# Altium project Battery Management System Rev3.PrjPcb
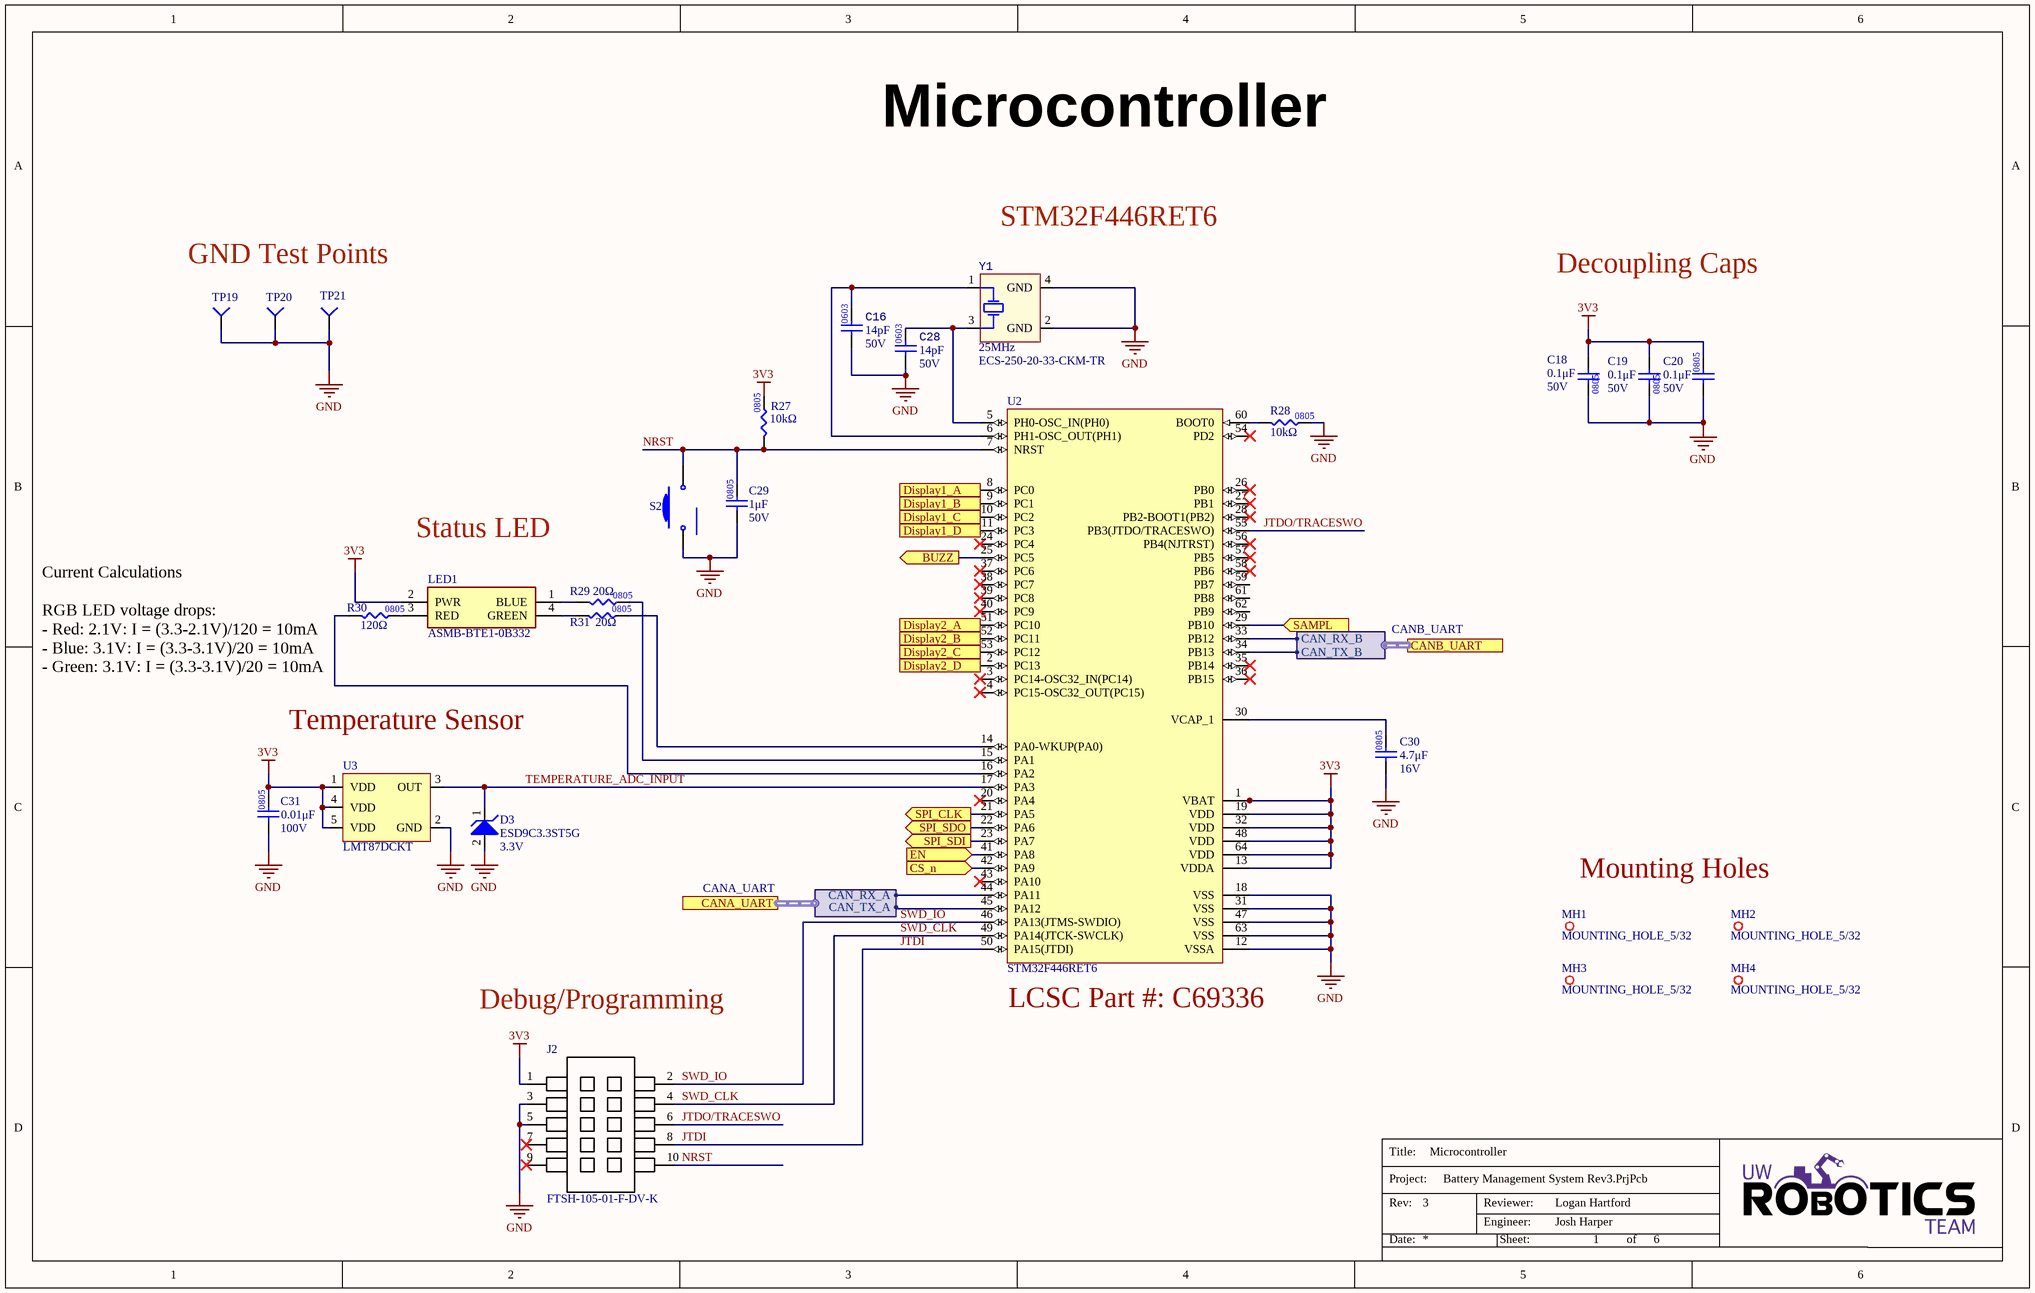
[diagram p0: Microcontroller.SchDoc]
6 sheets, 150 parts. Net scope: flat (ports and power ports of the same name join across sheets).
Board file: BMSRev3.PcbDoc
Sheets:
  Microcontroller.SchDoc
  BMSRev3.SchDoc
  BatteryBalancingRev3.SchDoc
  Display.SchDoc
  Power.SchDoc
  CAN.SchDoc

## Sheet Microcontroller.SchDoc: Microcontroller
size B; CheckedBy: Logan Hartford; Engineer: Josh Harper; Organization: UW Robotics; Address1: 200 University Avenue; Address2: Waterloo; Address3: Ontario; Address4: Canada N2L 3G6; DocumentNumber: 7; Revision: 3; SheetNumber: 1; SheetTotal: 6

### Parts
C16  value 14pF  Voltage Rating: 50V  [CAP0603]  (hidden comment: CAP_14pF_50V_0603)
C18  value 0.1μF  Voltage Rating: 50V  [CAP2012]  (hidden comment: CAP_0.1uF_50V_0805)
C19  value 0.1μF  Voltage Rating: 50V  [CAP2012]  (hidden comment: CAP_0.1uF_50V_0805)
C20  value 0.1μF  Voltage Rating: 50V  [CAP2012]  (hidden comment: CAP_0.1uF_50V_0805)
C28  value 14pF  Voltage Rating: 50V  [CAP0603]  (hidden comment: CAP_14pF_50V_0603)
C29  value 1μF  Voltage Rating: 50V  [CAP2012]  (hidden comment: CAP_1uF_50V_0805)
C30  value 4.7μF  Voltage Rating: 16V  [CAP0805]  (hidden comment: CAP_4.7uF_16V_0805)
C31  value 0.01μF  Voltage Rating: 100V  [CAP0805]  (hidden comment: CAP_0.01uF_100V_0805)
D3  ESD9C3.3ST5G  Voltage: 3.3V  [ESD9C3.3ST5G]
J2  Manufacturer Part Number 1: FTSH-105-01-F-DV-K  [FTSH-105-01-F-DV-K-P-TR]  (hidden comment: CON_PROGRAMMING)
LED1  ASMB-BTE1-0B332  [ASMBBTE10B332]
MH1  MOUNTING_HOLE_5/32  [MOUNTING_HOLE_5/38]  (no BOM)
MH2  MOUNTING_HOLE_5/32  [MOUNTING_HOLE_5/38]  (no BOM)
MH3  MOUNTING_HOLE_5/32  [MOUNTING_HOLE_5/38]  (no BOM)
MH4  MOUNTING_HOLE_5/32  [MOUNTING_HOLE_5/38]  (no BOM)
R27  value 10kΩ  [RES0805]  (hidden comment: RES_10kΩ_0805_5%)
R28  value 10kΩ  [RES0805]  (hidden comment: RES_10kΩ_0805_5%)
R29  value 20Ω  [RES0805]  (hidden comment: RES_20Ω_0805_1%)
R30  value 120Ω  [RES0805]  (hidden comment: RES_120Ω_0805_1%)
R31  value 20Ω  [RES0805]  (hidden comment: RES_20Ω_0805_1%)
S2  SW_PUSHBUTTON  [TACTILE_SWITCH_SMD]  (value not drawn)
TP19  TESTPOINT_SMD_LOOP  [S1751-46R]  (value not drawn)
TP20  TESTPOINT_SMD_LOOP  [S1751-46R]  (value not drawn)
TP21  TESTPOINT_SMD_LOOP  [S1751-46R]  (value not drawn)
U2  STM32F446RET6  [STM-LQFP64_L]
U3  Manufacturer Part Number 1: LMT87DCKT  [SOT65P210X110-5N]  (hidden comment: IC_TEMP_SENSOR_2)
Y1  Frequency: 25MHz  Manufacturer Part Number 1: ECS-250-20-33-CKM-TR  [XTAL_ECS-250-20-33-CKM-TR]  (hidden comment: CRYSTAL_25MHZ_20PF)

### Ports
BUZZ (out), CANA_UART (harness CANA_UART), CANB_UART (harness CANB_UART), CS_n (in), Display1_A (out), Display1_B (out), Display1_C (out), Display1_D (out), Display2_A (out), Display2_B (out), Display2_C (out), Display2_D (out), EN (in), SAMPL (in), SPI_CLK (out), SPI_SDI (out), SPI_SDO (out)

### Harnesses
CANB_UART: CAN_RX_B, CAN_TX_B
CANA_UART: CAN_RX_A, CAN_TX_A

### Nets
3V3: C18.2 C19.2 C20.2 C31.2 J2.1 LED1.2(PWR) R27.2 U2.1(VBAT) U2.13(VDDA) U2.19(VDD) U2.32(VDD) U2.48(VDD) U2.64(VDD) U3.1(VDD) U3.4(VDD) U3.5(VDD)
GND: C16.1 C18.1 C19.1 C20.1 C28.1 C29.1 C30.1 C31.1 D3.2 J2.3 J2.5 R28.2 S2.1 TP19.1(=value) TP20.1(=value) TP21.1(=value) U2.12(VSSA) U2.18(VSS) U2.31(VSS) U2.47(VSS) U2.63(VSS) U3.2(GND) Y1.2(GND) Y1.4(GND)
EN: U2.41(PA8) ; port EN
JTDI: J2.8 U2.50(PA15(JTDI))
JTDO/TRACESWO: J2.6 U2.55(PB3(JTDO/TRACESWO))
NRST: C29.2 J2.10 R27.1 S2.2 U2.7(NRST)
SWD_CLK: J2.4 U2.49(PA14(JTCK-SWCLK))
SWD_IO: J2.2 U2.46(PA13(JTMS-SWDIO))
TEMPERATURE_ADC_INPUT: D3.1 U2.17(PA3) U3.3(OUT)
NetC16_2: C16.2 U2.6(PH1-OSC_OUT(PH1)) Y1.1(HOT)
NetC28_2: C28.2 U2.5(PH0-OSC_IN(PH0)) Y1.3(HOT)
NetC30_2: C30.2 U2.30(VCAP_1)
NetLED1_1: LED1.1(BLUE) R29.1
NetLED1_3: LED1.3(RED) R30.2
NetLED1_4: LED1.4(GREEN) R31.1
NetQ1_1: U2.25(PC5) ; port BUZZ
NetR28_1: R28.1 U2.60(BOOT0)
NetR29_2: R29.2 U2.15(PA1)
NetR30_1: R30.1 U2.16(PA2)
NetR31_2: R31.2 U2.14(PA0-WKUP(PA0))
NetTP16_1: U2.21(PA5) ; port SPI_CLK
NetTP17_1: U2.23(PA7) ; port SPI_SDI
NetTP18_1: U2.22(PA6) ; port SPI_SDO
NetU1_4: U2.29(PB10) ; port SAMPL
NetU1_80: U2.42(PA9) ; port CS_n
NetU2_2: U2.2(PC13) ; port Display2_D
NetU2_8: U2.8(PC0) ; port Display1_A
NetU2_9: U2.9(PC1) ; port Display1_B
NetU2_10: U2.10(PC2) ; port Display1_C
NetU2_11: U2.11(PC3) ; port Display1_D
NetU2_33: U2.33(PB12) ; port CANB_UART.CAN_RX_B
NetU2_34: U2.34(PB13) ; port CANB_UART.CAN_TX_B
NetU2_44: U2.44(PA11) ; port CANA_UART.CAN_RX_A
NetU2_45: U2.45(PA12) ; port CANA_UART.CAN_TX_A
NetU2_51: U2.51(PC10) ; port Display2_A
NetU2_52: U2.52(PC11) ; port Display2_B
NetU2_53: U2.53(PC12) ; port Display2_C

Not connected (* = marked no-connect by the designer): J2 7* 9*; U2 3(PC14-OSC32_IN(PC14))* 4(PC15-OSC32_OUT(PC15))* 20(PA4)* 24(PC4)* 26(PB0)* 27(PB1)* 28(PB2-BOOT1(PB2))* 35(PB14)* 36(PB15)* 37(PC6)* 38(PC7)* 39(PC8)* 40(PC9)* 43(PA10)* 54(PD2)* 56(PB4(NJTRST))* 57(PB5)* 58(PB6)* 59(PB7) 61(PB8) 62(PB9)

### Notes on the sheet
- Microcontroller
- STM32F446RET6
- GND Test Points
- Decoupling Caps
- Status LED
- (near R30) Current Calculations
  RGB LED voltage drops:
  - Red: 2.1V: I = (3.3-2.1V)/120 = 10mA
  - Blue: 3.1V: I = (3.3-3.1V)/20 = 10mA
  - Green: 3.1V: I = (3.3-3.1V)/20 = 10mA
- Temperature Sensor
- Mounting Holes
- Debug/Programming
- (near U2) LCSC Part #: C69336
- Title:
- Project:
- Date:
- Rev:
- Reviewer:
- Engineer:
- Sheet:
- of

### Library data of the parts
C16 C28 = CAP_14pF_50V_0603: CAP CER 14PF 50V C0G/NP0 0603; Manufacturer 1: Samsung; Manufacturer Part Number 1: CL10C140JB8NNNC; Dielectric: C0G; Supplier 1: Digi-Key; Supplier Part Number 1: 1276-2187-1-ND; Mounting Type: SMD; Package: 0603
C18-C20 = CAP_0.1uF_50V_0805: CAP CER 0.1UF 50V X7R 0805; Manufacturer Part Number 1: GCM21BR71H104KA37K; Manufacturer 1: Murata Electronics; Package/Footprint: 0805; Supplier Part Number 1: 490-8049-1-ND; Supplier 1: Digi-Key; Dielectric: X7R; LCSC Part #: C49678; Mounting Type: SMD
C29 = CAP_1uF_50V_0805: CAP CER 1UF 50V X7R 0805; Manufacturer 1: Samsung Electro-Mechanics; Manufacturer Part Number 1: CL21B105KBFNNNG; Supplier 1: Digi-Key; Supplier Part Number 1: 1276-6470-1-ND; LCSC Part #: C28323; Mounting Type: SMD; Package: 0805
C30 = CAP_4.7uF_16V_0805: CAP CER 4.7UF 16V X5R 0805; Manufacturer Part Number 1: CL21A475KOFNNNE; Manufacturer 1: Samsung Electro-Mechanics; Supplier Part Number 1: 1276-1065-1-ND; Supplier 1: Digi-Key; Dielectric: X5R; LCSC Part #: C1779; Mounting Type: SMD; Package: 0805
C31 = CAP_0.01uF_100V_0805: CAP CER 0.01uF 100V X7R 0805; Manufacturer Part Number 1: 08051C103KAT2A; Manufacturer 1: AVX Corporation; Supplier Part Number 1: 478-1358-1-ND; Supplier 1: Digi-Key; Dielectric: X7R; LCSC Part #: C1710; Mounting Type: SMD; Package: 0805
D3 = ESD9C3.3ST5G: TVS DIODE 3.3VWM SOD923; Manufacturer Part Number 1: ESD9C3.3ST5G
J2 = CON_PROGRAMMING: CONN HEADER SMD 10POS 1.27MM; Manufacturer 1: Samtec; Supplier 1: Digi-Key; Pitch: 1.27mm; Supplier Part Number 1: SAM8796-ND; Mounting Type: SMD
LED1 = ASMB-BTE1-0B332: LED RGB DIFFUSED 4PLCC SMD; Manufacturer_Name: Avago Technologies; Datasheet Link: https://docs.broadcom.com/doc/AV02-4236EN; Height: 2.1mm; Mouser Part Number: 630-ASMB-BTE1-0B332; Mouser Price/Stock: https://www.mouser.co.uk/ProductDetail/Broadcom-Avago/ASMB-BTE1-0B332?qs=ToP8pWlZ0bOzYR3dfJnh3g%3D%3D; Manufacturer Part Number 1: ASMB-BTE1-0B332
R27 R28 = RES_10kΩ_0805_5%: RES 10K OHM 5% 1/8W 0805; Manufacturer 1: Panasonic Electronic Components; Manufacturer Part Number 1: ERJ-6GEYJ103V; Package/Footprint: 0805; Supplier Part Number 1: P10KACT-ND; Supplier 1: Digi-Key; LCSC Part #: C17414; Mounting Type: SMD
R29 R31 = RES_20Ω_0805_1%: RES 20 OHM 1% 1/8W 0805; Manufacturer 1: Yageo; Manufacturer Part Number 1: RC0805FR-0720RL; Supplier Part Number 1: 311-20.0CRCT-ND; Supplier 1: Digi-Key; LCSC Part #: C17581; Mounting Type: SMD; Package: 0805
R30 = RES_120Ω_0805_1%: RES 120 OHM 1% 1/8W 0805; Manufacturer 1: Vishay; Manufacturer Part Number 1: CRCW0805120RFKEA; Package/Footprint: 0805; Supplier Part Number 1: 541-120CCT-ND; Supplier 1: Digi-Key; LCSC Part #: C17437; Mounting Type: SMD
S2 = SW_PUSHBUTTON: SMT 3.0 X 2.6 MM TACT SWITCH WIT; Manufacturer Part Number 1: 435151014824; Manufacturer 1: Würth Elektronik; Supplier 1: Digi-Key; Supplier Part Number 1: 732-435151014824CT-ND
TP19-TP21 = TESTPOINT_SMD_LOOP: TESTPOINT SMD LOOP; Manufacturer 1: Harwin; Supplier 1: Digi-Key; Manufacturer Part Number 1: S1751-46R; Mounting Type: SMD; Package/Footprint: SMD; Supplier Part Number 1: 952-1478-1-ND
U2 = MCU_STM32F446RET6: ARM Cortex-M4 32-bit MCU+FPU, 512 KB Flash, 128 KB Internal RAM, 50 I/Os, 64-Pin LQFP, -40 to 85 degC, Tray; I/Os (High Current): 50; Supply Voltage(Vcc) min (V): 1.7; Operating Frequency(F) (Processor speed) (MHz): 180; D/A Converter: 2; Internal RAM Size (kB): 128; FLASH Size (Prog) (kB): 512; Core: ARM Cortex-M4; ComponentLink1Description: Manufacturer URL; Package Reference: 64-Pin Low-profile Quad Flat Package, Body 10 x 10 mm, Pitch 0.5 mm; ComponentLink2URL: http://www.st.com/st-web-ui/static/active/en/resource/technical/document/datasheet/DM00141306.pdf; Packing: Tray; DatasheetVersion: Rev. 6; ComponentLink1URL: http://www.st.com/; ComponentLink2Description: Datasheet; Package Description: LQFP64; Mounting Technology: Surface Mount; Supplier Part Number 1: 497-15376-ND; Supplier 1: Digi-Key
U3 = IC_TEMP_SENSOR_2: SENSOR ANALOG -50C-150C SC70-5; Manufacturer 1: Texas Instruments; Supplier Part Number 1: 296-35730-1-ND; Supplier 1: Digi-Key; Mounting Type: SMD; Package/Footprint: SC70-5
Y1 = CRYSTAL_25MHZ_20PF: CRYSTAL 25.0000MHZ 20PF SMD; Manufacturer 1: ECS Inc.; Load Capacitance: 20pF; Supplier 1: Digi-Key; Supplier Part Number 1: XC1817CT-ND; Mounting Type: SMD; Package/Footprint: SMD

## Sheet BMSRev3.SchDoc: BMS
size 279 x 215 mm; CheckedBy: Farris Matar; Engineer: Josh Harper; Revision: 3; SheetNumber: 2; SheetTotal: 6
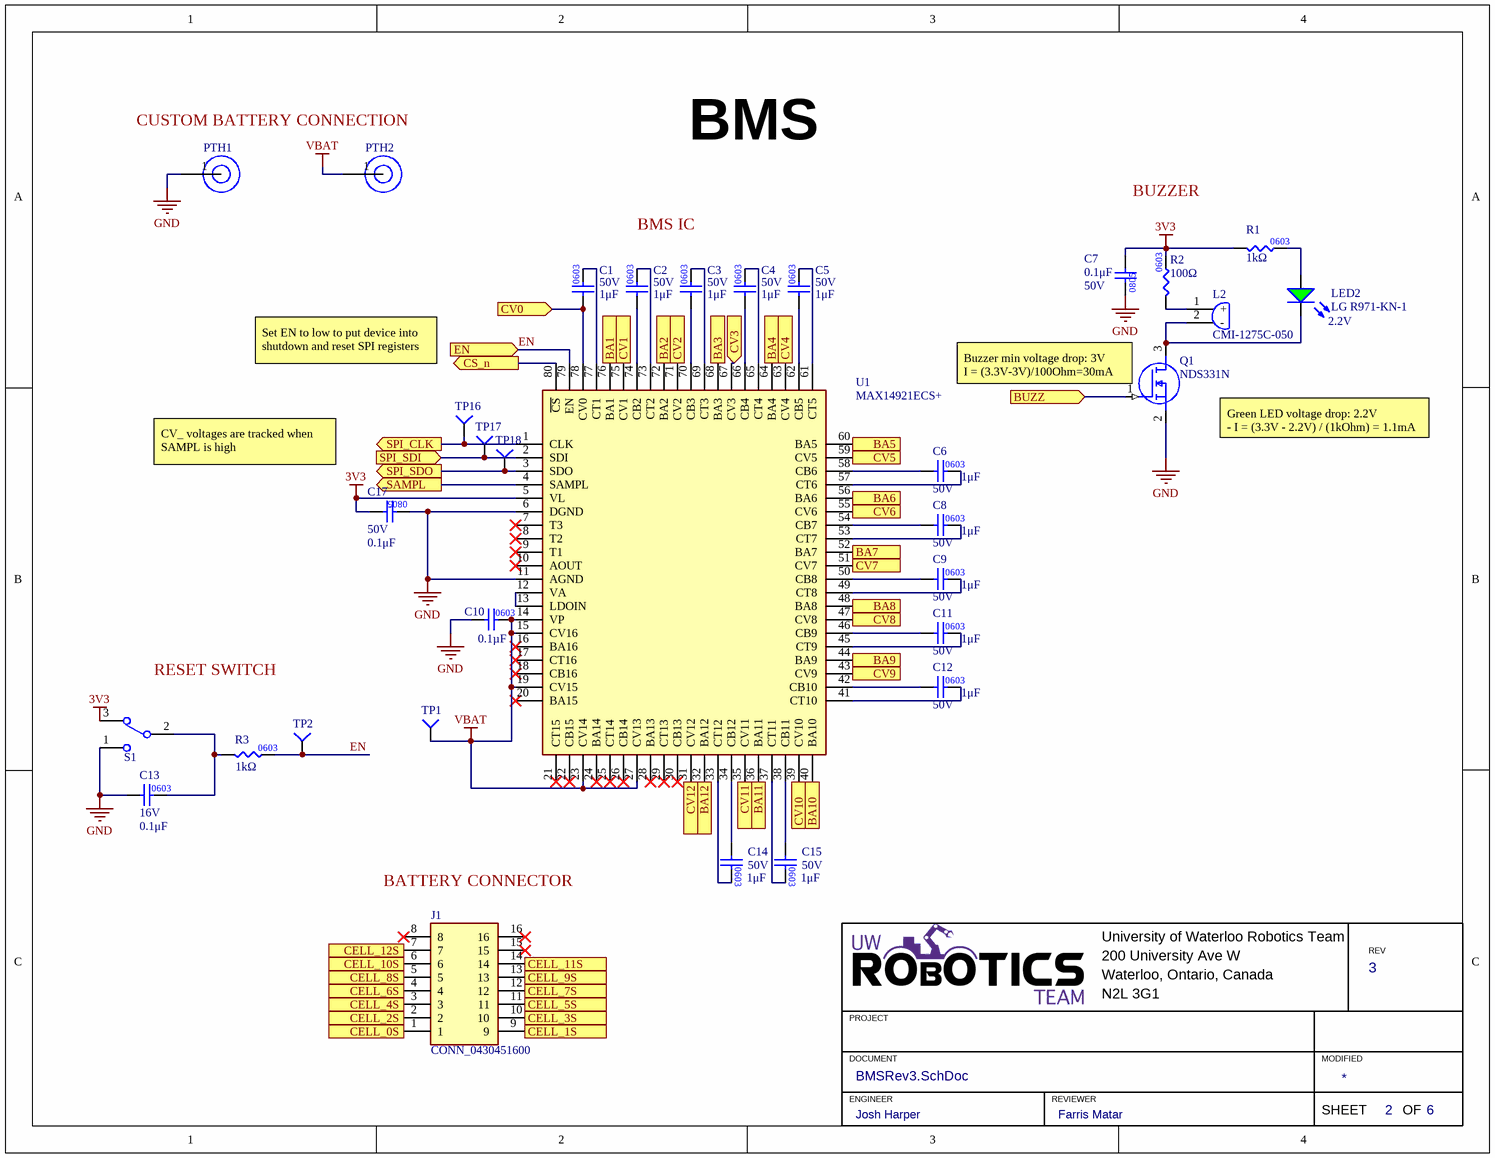
[diagram p1: BMSRev3.SchDoc]

### Parts
C1  value 1μF  Voltage Rating: 50V  [CAP0603]  (hidden comment: CAP_1uF_50V_0603)
C2  value 1μF  Voltage Rating: 50V  [CAP0603]  (hidden comment: CAP_1uF_50V_0603)
C3  value 1μF  Voltage Rating: 50V  [CAP0603]  (hidden comment: CAP_1uF_50V_0603)
C4  value 1μF  Voltage Rating: 50V  [CAP0603]  (hidden comment: CAP_1uF_50V_0603)
C5  value 1μF  Voltage Rating: 50V  [CAP0603]  (hidden comment: CAP_1uF_50V_0603)
C6  value 1μF  Voltage Rating: 50V  [CAP0603]  (hidden comment: CAP_1uF_50V_0603)
C7  value 0.1μF  Voltage Rating: 50V  [CAP2012]  (hidden comment: CAP_0.1uF_50V_0805)
C8  value 1μF  Voltage Rating: 50V  [CAP0603]  (hidden comment: CAP_1uF_50V_0603)
C9  value 1μF  Voltage Rating: 50V  [CAP0603]  (hidden comment: CAP_1uF_50V_0603)
C10  value 0.1µF  [CAP0603]  (hidden comment: CAP_0.1uF_10V_0603)
C11  value 1μF  Voltage Rating: 50V  [CAP0603]  (hidden comment: CAP_1uF_50V_0603)
C12  value 1μF  Voltage Rating: 50V  [CAP0603]  (hidden comment: CAP_1uF_50V_0603)
C13  value 0.1μF  Voltage Rating: 16V  [CAP0603]  (hidden comment: CAP_0.1uF_16V_0603)
C14  value 1μF  Voltage Rating: 50V  [CAP0603]  (hidden comment: CAP_1uF_50V_0603)
C15  value 1μF  Voltage Rating: 50V  [CAP0603]  (hidden comment: CAP_1uF_50V_0603)
C17  value 0.1μF  Voltage Rating: 50V  [CAP2012]  (hidden comment: CAP_0.1uF_50V_0805)
J1  CONN_0430451600  [0430451600]
L2  CMI-1275C-050  [CMI1275C050]
LED2  Forward Voltage Drop: 2.2V  Manufacturer Part Number 1: LG R971-KN-1  [LED_0805_GREEN]  (hidden comment: LED_GREEN)
PTH1  PTH  [PTH]  (value not drawn)
PTH2  PTH  [PTH]  (value not drawn)
Q1  NDS331N  [SOT95P251X112-3N]
R1  value 1kΩ  [RES0603]  (hidden comment: RES_1kΩ_0603_5%)
R2  value 100Ω  [RES0603]  (hidden comment: RES_100Ω_0603_1%)
R3  value 1kΩ  [RES0603]  (hidden comment: RES_1kΩ_0603_5%)
S1  SW_TOGGLE_SPDT  [100SP1T1B4M2QE]  (value not drawn)
TP1  TESTPOINT_1MM_SQUARE  [TESTPOINT_SQUARE_1MM]  (value not drawn)  (no BOM)
TP2  TESTPOINT_1MM_SQUARE  [TESTPOINT_SQUARE_1MM]  (value not drawn)  (no BOM)
TP16  TESTPOINT_1MM_SQUARE  [TESTPOINT_SQUARE_1MM]  (value not drawn)  (no BOM)
TP17  TESTPOINT_1MM_SQUARE  [TESTPOINT_SQUARE_1MM]  (value not drawn)  (no BOM)
TP18  TESTPOINT_1MM_SQUARE  [TESTPOINT_SQUARE_1MM]  (value not drawn)  (no BOM)
U1  MAX14921ECS+  [QFP50P1400X1400X120-80N]

### Ports
BA1 (out), BA2 (out), BA3 (out), BA4 (out), BA5 (out), BA6 (out), BA7 (out), BA8 (out), BA9 (out), BA10 (out), BA11 (out), BA12 (out), BUZZ (in), CELL_0S (out), CELL_1S (out), CELL_2S (out), CELL_3S (out), CELL_4S (out), CELL_5S (out), CELL_6S (out), CELL_7S (out), CELL_8S (out), CELL_9S (out), CELL_10S (out), CELL_11S (out), CELL_12S (out), CS_n (out), CV0 (in), CV1 (in), CV2 (in), CV3 (in), CV4 (in), CV5 (in), CV6 (in), CV7 (in), CV8 (in), CV9 (in), CV10 (in), CV11 (in), CV12 (in), EN (in), SAMPL (out), SPI_CLK (out), SPI_SDI (in), SPI_SDO (out)

### Nets
3V3: C7.2 C17.2 R1.1 R2.2 S1.3 U1.5(VL)
GND: C1.1 C7.1 C10.1 C13.1 C17.1 J1.1 PTH1.1 Q1.2(S) S1.1 U1.6(DGND) U1.11(AGND) U1.78(CV0) ; port CELL_0S, port CV0
VBAT: C10.2 PTH2.1 TP1.1(=value) U1.14(VP) U1.15(CV16) U1.19(CV15) U1.23(CV14) U1.27(CV13)
Cell6: J1.4 ; port CELL_6S
EN: R3.2 TP2.1(=value) U1.79(EN) ; port EN
NetC1_2: C1.2 U1.77(CT1)
NetC2_1: C2.1 U1.74(CB2)
NetC2_2: C2.2 U1.73(CT2)
NetC3_1: C3.1 U1.70(CB3)
NetC3_2: C3.2 U1.69(CT3)
NetC4_1: C4.1 U1.66(CB4)
NetC4_2: C4.2 U1.65(CT4)
NetC5_1: C5.1 U1.62(CB5)
NetC5_2: C5.2 U1.61(CT5)
NetC6_1: C6.1 U1.58(CB6)
NetC6_2: C6.2 U1.57(CT6)
NetC8_1: C8.1 U1.54(CB7)
NetC8_2: C8.2 U1.53(CT7)
NetC9_1: C9.1 U1.50(CB8)
NetC9_2: C9.2 U1.49(CT8)
NetC11_1: C11.1 U1.46(CB9)
NetC11_2: C11.2 U1.45(CT9)
NetC12_1: C12.1 U1.42(CB10)
NetC12_2: C12.2 U1.41(CT10)
NetC13_2: C13.2 R3.1 S1.2
NetC14_1: C14.1 U1.34(CB12)
NetC14_2: C14.2 U1.33(CT12)
NetC15_1: C15.1 U1.38(CB11)
NetC15_2: C15.2 U1.37(CT11)
NetJ1_2: J1.2 ; port CELL_2S
NetJ1_3: J1.3 ; port CELL_4S
NetJ1_5: J1.5 ; port CELL_8S
NetJ1_6: J1.6 ; port CELL_10S
NetJ1_7: J1.7 U1.31(CV12) ; port CV12, port CELL_12S
NetJ1_9: J1.9 ; port CELL_1S
NetJ1_10: J1.10 ; port CELL_3S
NetJ1_11: J1.11 ; port CELL_5S
NetJ1_12: J1.12 ; port CELL_7S
NetJ1_13: J1.13 ; port CELL_9S
NetJ1_14: J1.14 ; port CELL_11S
NetL2_1: L2.1(+) R2.1
NetL2_2: L2.2(-) LED2.2(K) Q1.3(D)
NetLED2_1: LED2.1(A) R1.2
NetQ1_1: Q1.1(G) ; port BUZZ
NetQ2_1: U1.32(BA12) ; port BA12
NetQ3_1: U1.56(BA6) ; port BA6
NetQ4_1: U1.60(BA5) ; port BA5
NetQ5_1: U1.36(BA11) ; port BA11
NetQ6_1: U1.40(BA10) ; port BA10
NetQ7_1: U1.64(BA4) ; port BA4
NetQ8_1: U1.44(BA9) ; port BA9
NetQ9_1: U1.68(BA3) ; port BA3
NetQ10_1: U1.48(BA8) ; port BA8
NetQ11_1: U1.72(BA2) ; port BA2
NetQ12_1: U1.52(BA7) ; port BA7
NetQ13_1: U1.76(BA1) ; port BA1
NetR4_2: U1.55(CV6) ; port CV6
NetR7_2: U1.59(CV5) ; port CV5
NetR8_2: U1.35(CV11) ; port CV11
NetR11_2: U1.39(CV10) ; port CV10
NetR12_2: U1.63(CV4) ; port CV4
NetR15_2: U1.43(CV9) ; port CV9
NetR16_2: U1.67(CV3) ; port CV3
NetR19_2: U1.47(CV8) ; port CV8
NetR20_2: U1.71(CV2) ; port CV2
NetR23_2: U1.51(CV7) ; port CV7
NetR24_2: U1.75(CV1) ; port CV1
NetTP16_1: TP16.1(=value) U1.1(CLK) ; port SPI_CLK
NetTP17_1: TP17.1(=value) U1.2(SDI) ; port SPI_SDI
NetTP18_1: TP18.1(=value) U1.3(SDO) ; port SPI_SDO
NetU1_4: U1.4(SAMPL) ; port SAMPL
NetU1_12: U1.12(VA) U1.13(LDOIN)
NetU1_80: U1.80(~{CS}) ; port CS_n

Not connected (* = marked no-connect by the designer): J1 8* 15* 16*; U1 7(T3)* 8(T2)* 9(T1)* 10(AOUT)* 16(BA16)* 17(CT16)* 18(CB16)* 20(BA15)* 21(CT15)* 22(CB15)* 24(BA14)* 25(CT14)* 26(CB14)* 28(BA13)* 29(CT13)* 30(CB13)*

### Notes on the sheet
- CUSTOM BATTERY CONNECTION
- BMS IC
- BUZZER
- Set EN to low to put device into shutdown and reset SPI registers
- (near Q1) Buzzer min voltage drop: 3V
  I = (3.3V-3V)/100Ohm=30mA
- Green LED voltage drop: 2.2V
  - I = (3.3V - 2.2V) / (1kOhm) = 1.1mA
- CV_ voltages are tracked when SAMPL is high
- (near S1) RESET SWITCH
- (near J1) BATTERY CONNECTOR
- University of Waterloo Robotics Team
- 200 University Ave W
- REV
- PROJECT
- Waterloo, Ontario, Canada
- N2L 3G1
- DOCUMENT
- ENGINEER
- REVIEWER
- MODIFIED
- SHEET
- OF
- (in symbol CAP_0.1uF_10V_0603) 0603
- (in symbol CAP_1uF_50V_0603) 0603
- (in symbol RES_100Ω_0603_1%) 0603

### Library data of the parts
C1-C6 C8 C9 C11 C12 C14 C15 = CAP_1uF_50V_0603: CAP CER 1UF 50V X6S 0603; Manufacturer Part Number 1: C1608X6S1H105K080AC; Manufacturer 1: TDK Corporation; Supplier Part Number 1: 445-7424-1-ND; Supplier 1: Digi-Key; Dielectric: X6S
C7 C17 = CAP_0.1uF_50V_0805: as C18 on sheet Microcontroller; Supplier Part Number 1: 490-8049-1-ND; Supplier 1: Digi-Key; Dielectric: X7R; LCSC Part #: C49678; Mounting Type: SMD
C10 = CAP_0.1uF_10V_0603: CAP CER 0.1UF 10V X7R 0402; Manufacturer 1: Murata Electronics; Manufacturer Part Number 1: GRM155R71A104KA01D; Package/Footprint: 0402; Supplier 1: Digi-Key; Supplier Part Number 1: 490-6321-1-ND; Voltage Rating: 10V
C13 = CAP_0.1uF_16V_0603: CAP CER 0.1UF 16V X7R 0603; Manufacturer Part Number 1: CC0603KRX7R7BB104; Manufacturer 1: Yageo; Package/Footprint: 0603; Supplier Part Number 1: 311-1088-1-ND; Supplier 1: Digi-Key; Dielectric: X7R; LCSC Number: C108079
J1 = CONN_0430451600: Connector 16 Pin AJX; Manufacturer_Name: Molex; Datasheet Link: https://www.molex.com/pdm_docs/sd/430451600_sd.pdf; Height: 9.02mm; Arrow Part Number: 0430451600; Arrow Price/Stock: https://www.arrow.com/en/products/0430451600/molex; Manufacturer Part Number 1: 0430451600
L2 = CMI-1275C-050: Inductor; Manufacturer_Name: CUI Inc.; Datasheet Link: https://componentsearchengine.com/Datasheets/1/CMI-1275C-050.pdf; Height: 8mm; Mouser Part Number: 490-CMI-1275C-050; Mouser Price/Stock: https://www.mouser.co.uk/ProductDetail/CUI-Devices/CMI-1275C-050?qs=qCxwlXJ4fnyWvfqXc%252BNqAA%3D%3D; Arrow Part Number: CMI-1275C-050; Arrow Price/Stock: https://www.arrow.com/en/products/cmi-1275c-050/cui-inc; Manufacturer Part Number 1: CMI-1275C-050
LED2 = LED_GREEN: LED GREEN DIFFUSED 0805 SMD; Manufacturer 1: OSRAM; Package/Footprint: 0805; Supplier Part Number 1: 475-1410-1-ND; Supplier 1: Digi-Key; Mounting Type: SMD
Q1 = NDS331N: MOSFET (N-Channel); Manufacturer_Name: onsemi; Datasheet Link: https://www.onsemi.com/pub/Collateral/NDS331N-D.PDF; Height: 1.12mm; Mouser Part Number: 512-NDS331N; Mouser Price/Stock: https://www.mouser.co.uk/ProductDetail/ON-Semiconductor-Fairchild/NDS331N?qs=FOlmdCx%252BAA2del7Yv4IvDw%3D%3D; Manufacturer Part Number 1: NDS331N
R1 R3 = RES_1kΩ_0603_5%: RES 1K OHM 5% 1/10W 0603; Manufacturer 1: Yageo; Manufacturer Part Number 1: RC0603JR-071KL; Package/Footprint: 0603; Supplier Part Number 1: 311-1.0KGRCT-ND; Supplier 1: Digi-Key; Mounting Type: SMD; LCSC Number: C14676
R2 = RES_100Ω_0603_1%: RES 100 OHM 1% 1/10W 0603; Manufacturer 1: Yageo; Manufacturer Part Number 1: RC0603FR-07100RL; Supplier Part Number 1: 311-100HRCT-ND; Supplier 1: Digi-Key
S1 = SW_TOGGLE_SPDT: SWITCH TOGGLE SPDT 5A 120V; Manufacturer 1: E-Switch; Voltage Rating (DC): 28V; Package/Footprint: TH; Supplier 1: Digi-Key; Mounting Type: TH; Throw Configuration: SPDT; Supplier Part Number 1: EG2355-ND; Manufacturer Part Number 1: 100SP1T1B4M2QE
TP1 TP2 TP16-TP18 = TESTPOINT_1MM_SQUARE: TESTPOINT 1MM SQUARE
U1 = MAX14921ECS+: IC 16s BMS; Manufacturer_Name: Maxim Integrated; Datasheet Link: http://pdfserv.maximintegrated.com/package_dwgs/21-0072.PDF; Height: 1.2mm; Mouser Part Number: 700-MAX14921ECS+; Mouser Price/Stock: https://www.mouser.co.uk/ProductDetail/Maxim-Integrated/MAX14921ECS%2b?qs=Vwh6e7toGLhlnKi5DjCusg%3D%3D; Manufacturer Part Number 1: MAX14921ECS+

## Sheet BatteryBalancingRev3.SchDoc: Passive Cell Balancing Circuit
size 279 x 215 mm; Engineer: Josh Harper; Revision: 3; SheetNumber: 3; SheetTotal: 6
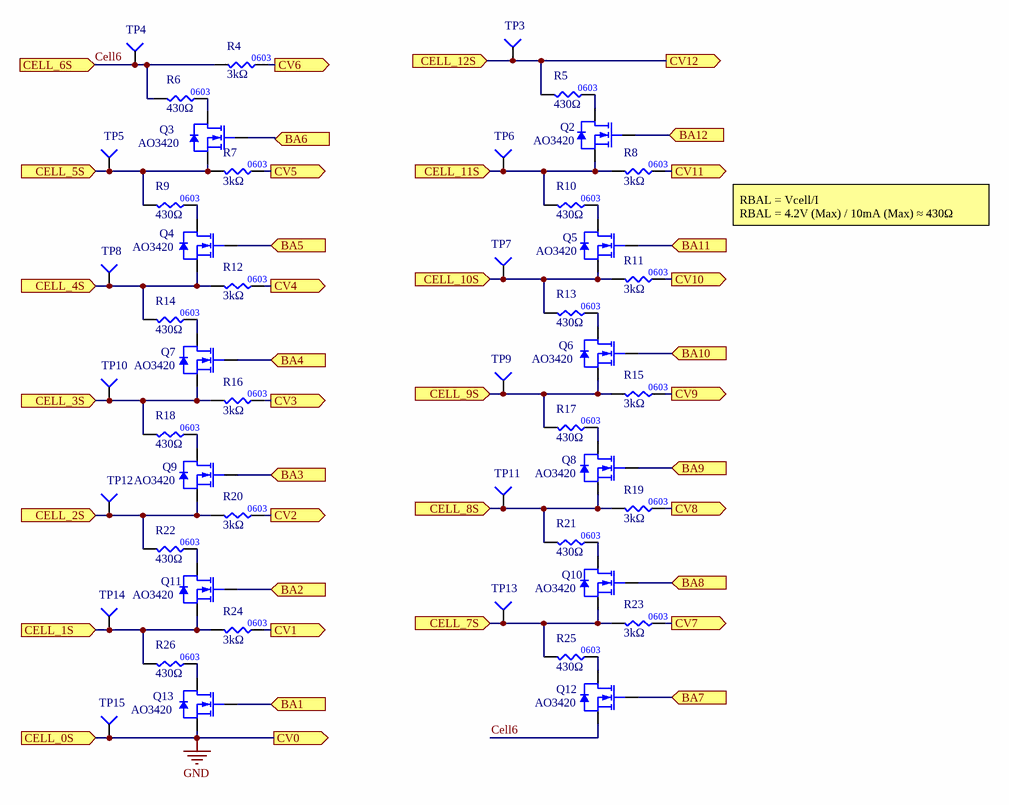
[diagram p2: BatteryBalancingRev3.SchDoc]

### Parts
Q2  Manufacturer Part Number 1: AO3420  [SOT23-3]  (hidden comment: NMOS_20V_6A)
Q3  Manufacturer Part Number 1: AO3420  [SOT23-3]  (hidden comment: NMOS_20V_6A)
Q4  Manufacturer Part Number 1: AO3420  [SOT23-3]  (hidden comment: NMOS_20V_6A)
Q5  Manufacturer Part Number 1: AO3420  [SOT23-3]  (hidden comment: NMOS_20V_6A)
Q6  Manufacturer Part Number 1: AO3420  [SOT23-3]  (hidden comment: NMOS_20V_6A)
Q7  Manufacturer Part Number 1: AO3420  [SOT23-3]  (hidden comment: NMOS_20V_6A)
Q8  Manufacturer Part Number 1: AO3420  [SOT23-3]  (hidden comment: NMOS_20V_6A)
Q9  Manufacturer Part Number 1: AO3420  [SOT23-3]  (hidden comment: NMOS_20V_6A)
Q10  Manufacturer Part Number 1: AO3420  [SOT23-3]  (hidden comment: NMOS_20V_6A)
Q11  Manufacturer Part Number 1: AO3420  [SOT23-3]  (hidden comment: NMOS_20V_6A)
Q12  Manufacturer Part Number 1: AO3420  [SOT23-3]  (hidden comment: NMOS_20V_6A)
Q13  Manufacturer Part Number 1: AO3420  [SOT23-3]  (hidden comment: NMOS_20V_6A)
R4  value 3kΩ  [RES0603]  (hidden comment: RES_3kΩ_0603_1%)
R5  value 430Ω  [RES0603]  (hidden comment: RES_430Ω_0603_5%)
R6  value 430Ω  [RES0603]  (hidden comment: RES_430Ω_0603_5%)
R7  value 3kΩ  [RES0603]  (hidden comment: RES_3kΩ_0603_1%)
R8  value 3kΩ  [RES0603]  (hidden comment: RES_3kΩ_0603_1%)
R9  value 430Ω  [RES0603]  (hidden comment: RES_430Ω_0603_5%)
R10  value 430Ω  [RES0603]  (hidden comment: RES_430Ω_0603_5%)
R11  value 3kΩ  [RES0603]  (hidden comment: RES_3kΩ_0603_1%)
R12  value 3kΩ  [RES0603]  (hidden comment: RES_3kΩ_0603_1%)
R13  value 430Ω  [RES0603]  (hidden comment: RES_430Ω_0603_5%)
R14  value 430Ω  [RES0603]  (hidden comment: RES_430Ω_0603_5%)
R15  value 3kΩ  [RES0603]  (hidden comment: RES_3kΩ_0603_1%)
R16  value 3kΩ  [RES0603]  (hidden comment: RES_3kΩ_0603_1%)
R17  value 430Ω  [RES0603]  (hidden comment: RES_430Ω_0603_5%)
R18  value 430Ω  [RES0603]  (hidden comment: RES_430Ω_0603_5%)
R19  value 3kΩ  [RES0603]  (hidden comment: RES_3kΩ_0603_1%)
R20  value 3kΩ  [RES0603]  (hidden comment: RES_3kΩ_0603_1%)
R21  value 430Ω  [RES0603]  (hidden comment: RES_430Ω_0603_5%)
R22  value 430Ω  [RES0603]  (hidden comment: RES_430Ω_0603_5%)
R23  value 3kΩ  [RES0603]  (hidden comment: RES_3kΩ_0603_1%)
R24  value 3kΩ  [RES0603]  (hidden comment: RES_3kΩ_0603_1%)
R25  value 430Ω  [RES0603]  (hidden comment: RES_430Ω_0603_5%)
R26  value 430Ω  [RES0603]  (hidden comment: RES_430Ω_0603_5%)
TP3  TESTPOINT_1MM_SQUARE  [TESTPOINT_SQUARE_1MM]  (value not drawn)  (no BOM)
TP4  TESTPOINT_1MM_SQUARE  [TESTPOINT_SQUARE_1MM]  (value not drawn)  (no BOM)
TP5  TESTPOINT_1MM_SQUARE  [TESTPOINT_SQUARE_1MM]  (value not drawn)  (no BOM)
TP6  TESTPOINT_1MM_SQUARE  [TESTPOINT_SQUARE_1MM]  (value not drawn)  (no BOM)
TP7  TESTPOINT_1MM_SQUARE  [TESTPOINT_SQUARE_1MM]  (value not drawn)  (no BOM)
TP8  TESTPOINT_1MM_SQUARE  [TESTPOINT_SQUARE_1MM]  (value not drawn)  (no BOM)
TP9  TESTPOINT_1MM_SQUARE  [TESTPOINT_SQUARE_1MM]  (value not drawn)  (no BOM)
TP10  TESTPOINT_1MM_SQUARE  [TESTPOINT_SQUARE_1MM]  (value not drawn)  (no BOM)
TP11  TESTPOINT_1MM_SQUARE  [TESTPOINT_SQUARE_1MM]  (value not drawn)  (no BOM)
TP12  TESTPOINT_1MM_SQUARE  [TESTPOINT_SQUARE_1MM]  (value not drawn)  (no BOM)
TP13  TESTPOINT_1MM_SQUARE  [TESTPOINT_SQUARE_1MM]  (value not drawn)  (no BOM)
TP14  TESTPOINT_1MM_SQUARE  [TESTPOINT_SQUARE_1MM]  (value not drawn)  (no BOM)
TP15  TESTPOINT_1MM_SQUARE  [TESTPOINT_SQUARE_1MM]  (value not drawn)  (no BOM)

### Ports
BA1 (in), BA2 (in), BA3 (in), BA4 (in), BA5 (in), BA6 (in), BA7 (in), BA8 (in), BA9 (in), BA10 (in), BA11 (in), BA12 (in), CELL_0S (in), CELL_1S (in), CELL_2S (in), CELL_3S (in), CELL_4S (in), CELL_5S (in), CELL_6S (in), CELL_7S (in), CELL_8S (in), CELL_9S (in), CELL_10S (in), CELL_11S (in), CELL_12S (in), CV0 (out), CV1 (out), CV2 (out), CV3 (out), CV4 (out), CV5 (out), CV6 (out), CV7 (out), CV8 (out), CV9 (out), CV10 (out), CV11 (out), CV12 (out)

### Nets
GND: Q13.2(SOURCE) TP15.1(=value) ; port CELL_0S, port CV0
Cell6: Q12.2(SOURCE) R4.1 R6.1 TP4.1(=value) ; port CELL_6S
NetJ1_2: Q9.2(SOURCE) R20.1 R22.1 TP12.1(=value) ; port CELL_2S
NetJ1_3: Q4.2(SOURCE) R12.1 R14.1 TP8.1(=value) ; port CELL_4S
NetJ1_5: Q8.2(SOURCE) R19.1 R21.1 TP11.1(=value) ; port CELL_8S
NetJ1_6: Q5.2(SOURCE) R11.1 R13.1 TP7.1(=value) ; port CELL_10S
NetJ1_7: R5.1 TP3.1(=value) ; port CELL_12S, port CV12
NetJ1_9: Q11.2(SOURCE) R24.1 R26.1 TP14.1(=value) ; port CELL_1S
NetJ1_10: Q7.2(SOURCE) R16.1 R18.1 TP10.1(=value) ; port CELL_3S
NetJ1_11: Q3.2(SOURCE) R7.1 R9.1 TP5.1(=value) ; port CELL_5S
NetJ1_12: Q10.2(SOURCE) R23.1 R25.1 TP13.1(=value) ; port CELL_7S
NetJ1_13: Q6.2(SOURCE) R15.1 R17.1 TP9.1(=value) ; port CELL_9S
NetJ1_14: Q2.2(SOURCE) R8.1 R10.1 TP6.1(=value) ; port CELL_11S
NetQ2_1: Q2.1(GATE) ; port BA12
NetQ2_3: Q2.3(DRAIN) R5.2
NetQ3_1: Q3.1(GATE) ; port BA6
NetQ3_3: Q3.3(DRAIN) R6.2
NetQ4_1: Q4.1(GATE) ; port BA5
NetQ4_3: Q4.3(DRAIN) R9.2
NetQ5_1: Q5.1(GATE) ; port BA11
NetQ5_3: Q5.3(DRAIN) R10.2
NetQ6_1: Q6.1(GATE) ; port BA10
NetQ6_3: Q6.3(DRAIN) R13.2
NetQ7_1: Q7.1(GATE) ; port BA4
NetQ7_3: Q7.3(DRAIN) R14.2
NetQ8_1: Q8.1(GATE) ; port BA9
NetQ8_3: Q8.3(DRAIN) R17.2
NetQ9_1: Q9.1(GATE) ; port BA3
NetQ9_3: Q9.3(DRAIN) R18.2
NetQ10_1: Q10.1(GATE) ; port BA8
NetQ10_3: Q10.3(DRAIN) R21.2
NetQ11_1: Q11.1(GATE) ; port BA2
NetQ11_3: Q11.3(DRAIN) R22.2
NetQ12_1: Q12.1(GATE) ; port BA7
NetQ12_3: Q12.3(DRAIN) R25.2
NetQ13_1: Q13.1(GATE) ; port BA1
NetQ13_3: Q13.3(DRAIN) R26.2
NetR4_2: R4.2 ; port CV6
NetR7_2: R7.2 ; port CV5
NetR8_2: R8.2 ; port CV11
NetR11_2: R11.2 ; port CV10
NetR12_2: R12.2 ; port CV4
NetR15_2: R15.2 ; port CV9
NetR16_2: R16.2 ; port CV3
NetR19_2: R19.2 ; port CV8
NetR20_2: R20.2 ; port CV2
NetR23_2: R23.2 ; port CV7
NetR24_2: R24.2 ; port CV1

### Notes on the sheet
- RBAL = Vcell/I
  RBAL = 4.2V (Max) / 10mA (Max) ≈ 430Ω
- University of Waterloo Robotics Team
- 200 University Ave W
- REV
- PROJECT
- Waterloo, Ontario, Canada
- N2L 3G1
- DOCUMENT
- ENGINEER
- REVIEWER
- MODIFIED
- SHEET
- OF
- (in symbol RES_3kΩ_0603_1%) 0603

### Library data of the parts
Q2-Q13 = NMOS_20V_6A: MOSFET N-CH 20V 6A SOT-23; Manufacturer 1: Alpha & Omega; Supplier 1: Digi-Key; Supplier Part Number 1: 785-1014-2-ND
R4 R7 R8 R11 R12 R15 R16 R19 R20 R23 R24 = RES_3kΩ_0603_1%: RES 3K OHM 1% 1/10W 0603; Manufacturer 1: Yageo; Manufacturer Part Number 1: RC0603FR-073KL; Supplier 1: Digi-Key; Supplier Part Number 1: 311-3.00KHRCT-ND
R5 R6 R9 R10 R13 R14 R17 R18 R21 R22 R25 R26 = RES_430Ω_0603_5%: RES 430 OHM 5% 1/10W 0603; Manufacturer 1: Stackpole Electronics; Manufacturer Part Number 1: RMCF0603JT430R; Package/Footprint: 0603; Supplier Part Number 1: RMCF0603JT430R; Supplier 1: Digi-Key; Mounting Type: SMD
TP3 = TESTPOINT_1MM_SQUARE: CELL6
TP4 TP6 = TESTPOINT_1MM_SQUARE: CELL11
TP5 = TESTPOINT_1MM_SQUARE: CELL5
TP7 = TESTPOINT_1MM_SQUARE: CELL10
TP8 = TESTPOINT_1MM_SQUARE: CELL4
TP9 = TESTPOINT_1MM_SQUARE: CELL9
TP10 = TESTPOINT_1MM_SQUARE: CELL3
TP11 = TESTPOINT_1MM_SQUARE: CELL8
TP12 = TESTPOINT_1MM_SQUARE: CELL2
TP13 = TESTPOINT_1MM_SQUARE: CELL7
TP14 = TESTPOINT_1MM_SQUARE: CELL1
TP15 = TESTPOINT_1MM_SQUARE: CELL0

## Sheet Display.SchDoc: Display
size A4; CheckedBy: Ari Wasch; Engineer: Josh Harper; Revision: 03; SheetNumber: 4; SheetTotal: 6
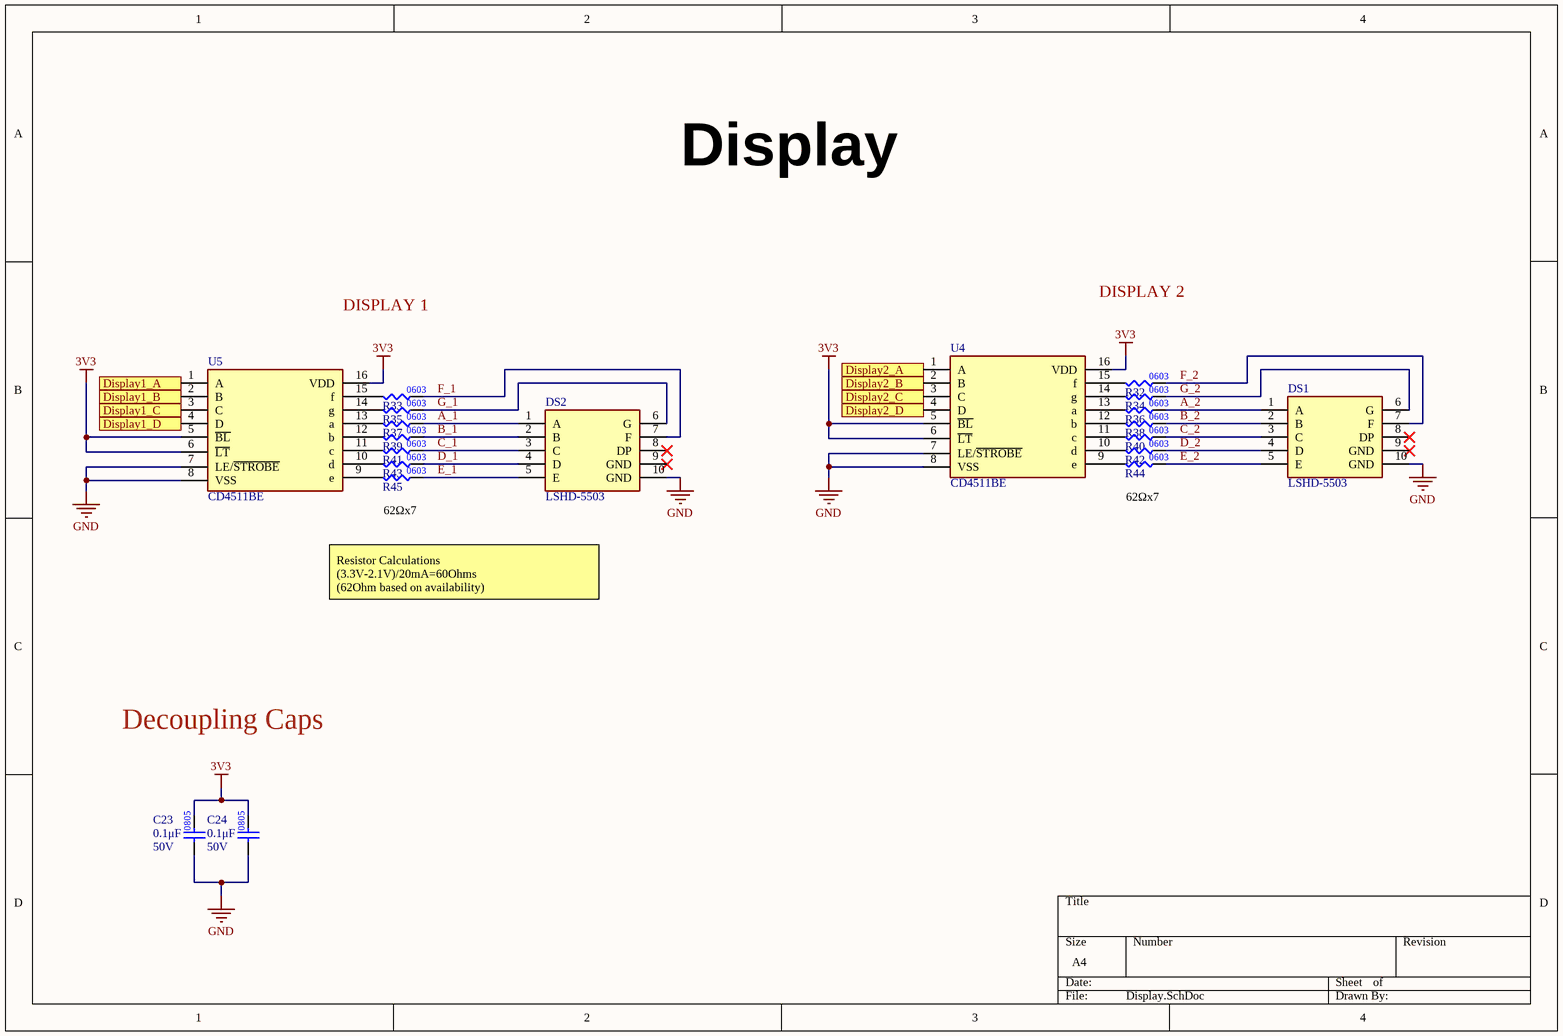
[diagram p3: Display.SchDoc]

### Parts
C23  value 0.1μF  Voltage Rating: 50V  [CAP2012]  (hidden comment: CAP_0.1uF_50V_0805)
C24  value 0.1μF  Voltage Rating: 50V  [CAP2012]  (hidden comment: CAP_0.1uF_50V_0805)
DS1  LSHD-5503  [DIPS1524W50P254L1240H825Q10N]
DS2  LSHD-5503  [DIPS1524W50P254L1240H825Q10N]
R32  RES_62Ω_0603_1%  (value not drawn)
R33  RES_62Ω_0603_1%  (value not drawn)
R34  RES_62Ω_0603_1%  (value not drawn)
R35  RES_62Ω_0603_1%  (value not drawn)
R36  RES_62Ω_0603_1%  (value not drawn)
R37  RES_62Ω_0603_1%  (value not drawn)
R38  RES_62Ω_0603_1%  (value not drawn)
R39  RES_62Ω_0603_1%  (value not drawn)
R40  RES_62Ω_0603_1%  (value not drawn)
R41  RES_62Ω_0603_1%  (value not drawn)
R42  RES_62Ω_0603_1%  (value not drawn)
R43  RES_62Ω_0603_1%  (value not drawn)
R44  RES_62Ω_0603_1%  (value not drawn)
R45  RES_62Ω_0603_1%  (value not drawn)
U4  CD4511BE  [DIP794W53P254L1930H508Q16N]
U5  CD4511BE  [DIP794W53P254L1930H508Q16N]

### Ports
Display1_A (in), Display1_B (in), Display1_C (in), Display1_D (in), Display2_A (in), Display2_B (in), Display2_C (in), Display2_D (in)

### Nets
3V3: C23.2 C24.2 U4.5(~{BL}) U4.6(~{LT}) U4.16(VDD) U5.5(~{BL}) U5.6(~{LT}) U5.16(VDD)
GND: C23.1 C24.1 DS1.10(GND) DS2.10(GND) U4.7(LE/~{STROBE}) U4.8(VSS) U5.7(LE/~{STROBE}) U5.8(VSS)
A_1: DS2.1(A) R37.2
A_2: DS1.1(A) R36.2
B_1: DS2.2(B) R39.2
B_2: DS1.2(B) R38.2
C_1: DS2.3(C) R41.2
C_2: DS1.3(C) R40.2
D_1: DS2.4(D) R43.2
D_2: DS1.4(D) R42.2
E_1: DS2.5(E) R45.2
E_2: DS1.5(E) R44.2
F_1: DS2.7(F) R33.2
F_2: DS1.7(F) R32.2
G_1: DS2.6(G) R35.2
G_2: DS1.6(G) R34.2
NetR32_1: R32.1 U4.15(f)
NetR33_1: R33.1 U5.15(f)
NetR34_1: R34.1 U4.14(g)
NetR35_1: R35.1 U5.14(g)
NetR36_1: R36.1 U4.13(a)
NetR37_1: R37.1 U5.13(a)
NetR38_1: R38.1 U4.12(b)
NetR39_1: R39.1 U5.12(b)
NetR40_1: R40.1 U4.11(c)
NetR41_1: R41.1 U5.11(c)
NetR42_1: R42.1 U4.10(d)
NetR43_1: R43.1 U5.10(d)
NetR44_1: R44.1 U4.9(e)
NetR45_1: R45.1 U5.9(e)
NetU2_2: U4.4(D) ; port Display2_D
NetU2_8: U5.1(A) ; port Display1_A
NetU2_9: U5.2(B) ; port Display1_B
NetU2_10: U5.3(C) ; port Display1_C
NetU2_11: U5.4(D) ; port Display1_D
NetU2_51: U4.1(A) ; port Display2_A
NetU2_52: U4.2(B) ; port Display2_B
NetU2_53: U4.3(C) ; port Display2_C

Not connected (* = marked no-connect by the designer): DS1 8(DP)* 9(GND)*; DS2 8(DP)* 9(GND)*

### Notes on the sheet
- Display
- DISPLAY 1
- DISPLAY 2
- 62Ωx7
- Resistor Calculations
  (3.3V-2.1V)/20mA=60Ohms
  (62Ohm based on availability)
- Decoupling Caps

### Library data of the parts
C23 C24 = CAP_0.1uF_50V_0805: as C18 on sheet Microcontroller; Supplier Part Number 1: 490-8049-1-ND; Supplier 1: Digi-Key; Dielectric: X7R; LCSC Part #: C49678; Mounting Type: SMD
DS1 DS2 = LSHD-5503: DISPLAY 7SEG 0.56" SGL RED 10DIP; Manufacturer_Name: Lite-On; Datasheet Link: https://componentsearchengine.com/Datasheets/1/LSHD-5503.pdf; Height: 8.25mm; Mouser Part Number: 859-LSHD-5503; Mouser Price/Stock: https://www.mouser.com/Search/Refine.aspx?Keyword=859-LSHD-5503; Arrow Part Number: LSHD-5503; Arrow Price/Stock: https://www.arrow.com/en/products/lshd-5503/lite-on-technology; Supplier Link: https://www.digikey.ca/en/products/detail/lite-on-inc/LSHD-5503/560009; Manufacturer Part Number 1: LSHD-5503
R32-R45 = RES_62Ω_0603_1%: RES 62 OHM 1% 1/10W 0603; Manufacturer: Vishay; Manufacturer Part Number 1: CRCW060362R0FKEA; Value: 62Ω; Supplier 1: Digi-Key; Supplier Part Number 1: 541-62.0HCT-ND; Package: 0603
U4 U5 = CD4511BE: Integrated Circuit; Manufacturer_Name: Texas Instruments; Datasheet Link: http://www.ti.com/lit/gpn/cd4511b; Height: 5.08mm; Mouser Part Number: 595-CD4511BE; Mouser Price/Stock: https://www.mouser.co.uk/ProductDetail/Texas-Instruments/CD4511BE?qs=pt%2FIv5r0EPdhGGYgwfpYEw%3D%3D; Arrow Part Number: CD4511BE; Arrow Price/Stock: https://www.arrow.com/en/products/cd4511be/texas-instruments?region=nac; Manufacturer Part Number 1: CD4511BE

## Sheet Power.SchDoc
size A4; SheetNumber: 5; SheetTotal: 6
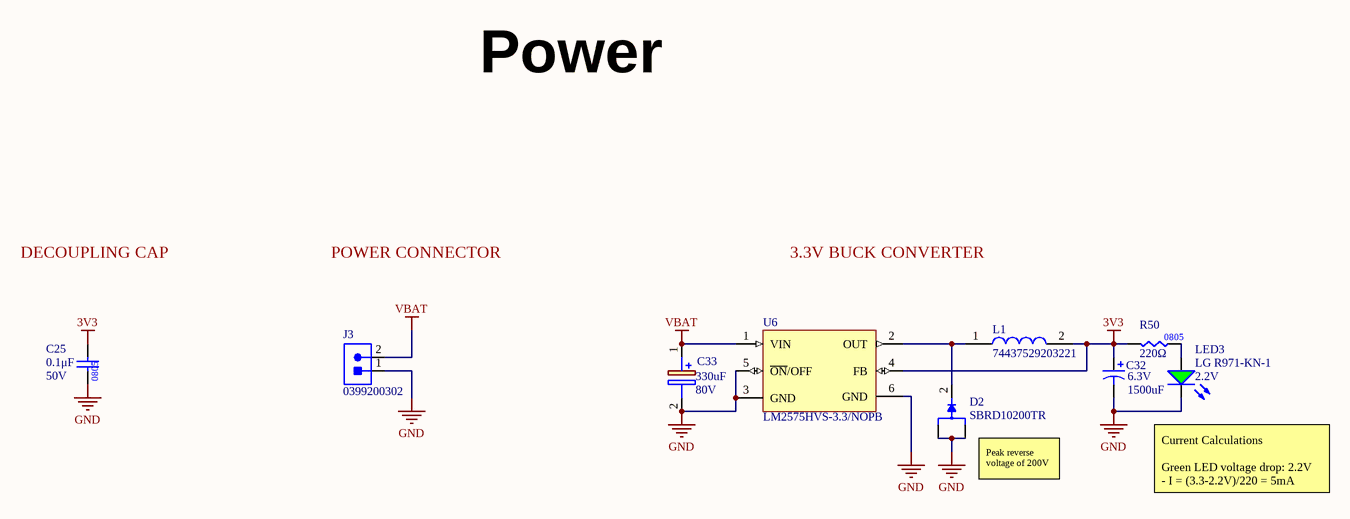
[diagram p4: Power.SchDoc]

### Parts
C25  value 0.1μF  Voltage Rating: 50V  [CAP2012]  (hidden comment: CAP_0.1uF_50V_0805)
C32  Voltage: 6.3V  Capacitance: 1500uF  [CAPAE1030X1080N]  (hidden comment: PCJ0J152MCL1GS)
C33  Capacitance: 330uF  Voltage: 80V  [EEEFK0J682AM]  (hidden comment: EEV-FK1K331M)
D2  SBRD10200TR  [DPAK228P1005X240-4N]
J3  Manufacturer Part Number 1: 0399200302  [MOLEX-0399200302]  (hidden comment: CONN_SCREW_TERM_115A)
L1  74437529203221  [74437529203221]
LED3  Forward Voltage Drop: 2.2V  Manufacturer Part Number 1: LG R971-KN-1  [LED_0805_GREEN]  (hidden comment: LED_GREEN)
R50  value 220Ω  [RES0805]  (hidden comment: RES_220Ω_0805_5%)
U6  LM2575HVS-3.3/NOPB  [VREG_TPS79625KTTR]

### Nets
3V3: C25.2 C32.1 L1.2 R50.1 U6.4(FB)
GND: C25.1 C32.2 C33.2(-) D2.1 D2.3 J3.1 LED3.2(K) U6.3(GND) U6.5(~{ON}/OFF) U6.6(GND)
VBAT: C33.1(+) J3.2 U6.1(VIN)
NetD2_2: D2.2 L1.1 U6.2(OUT)
NetLED3_1: LED3.1(A) R50.2

### Notes on the sheet
- Power
- DECOUPLING CAP
- POWER CONNECTOR
- 3.3V BUCK CONVERTER
- (near D2) Peak reverse voltage of 200V
- Current Calculations
  Green LED voltage drop: 2.2V
  - I = (3.3-2.2V)/220 = 5mA

### Library data of the parts
C25 = CAP_0.1uF_50V_0805: as C18 on sheet Microcontroller; Supplier Part Number 1: 490-8049-1-ND; Supplier 1: Digi-Key; Dielectric: X7R; LCSC Part #: C49678; Mounting Type: SMD
C33 = EEV-FK1K331M: Capacitor Polarised; Manufacturer_Name: Panasonic; Datasheet Link: http://industrial.panasonic.com/cdbs/www-data/pdf/RDE0000/ABA0000C1181.pdf; Height: 17mm; Mouser Part Number: 667-EEV-FK1K331M; Mouser Price/Stock: https://www.mouser.co.uk/ProductDetail/Panasonic/EEV-FK1K331M?qs=f%252BPvLx1Hi0niAwhZUCTEVQ%3D%3D; Manufacturer Part Number 1: EEV-FK1K331M
D2 = SBRD10200TR: SBRD10200 Series 200 V 10 A Surface Mount Schottky Rectifier - TO-252-3; Availability: Unavailable; Package: None; Value: *; Price: None; Manufacturer Part Number 1: SBRD10200TR
J3 = CONN_SCREW_TERM_115A: CONN TERM BLOCK 2POS 15MM 1-8AWG; Manufacturer 1: Molex; Pitch: 0.591inch; Wire Gauge (Max): 8AWG; Wire Gauge (Min): 1AWG; Supplier 1: Digi-Key; Supplier Part Number 1: WM20114-ND
L1 = 74437529203221: Inductor; Manufacturer_Name: Wurth Elektronik; Datasheet Link: https://www.mouser.com/datasheet/2/445/74437529203221-1280418.pdf; Height: 20.5mm; Mouser Part Number: 710-74437529203221; Mouser Price/Stock: https://www.mouser.co.uk/ProductDetail/Wurth-Elektronik/74437529203221?qs=f9yNj16SXrLAROUwbKRDKA%3D%3D; Manufacturer Part Number 1: 74437529203221
LED3 = LED_GREEN: as LED2 on sheet BMSRev3; Supplier Part Number 1: 475-1410-1-ND; Supplier 1: Digi-Key; Mounting Type: SMD
R50 = RES_220Ω_0805_5%: RES 220 OHM 5% 1/2W 0805; Manufacturer 1: Panasonic Electronic Components; Manufacturer Part Number 1: ERJ-P06J221V; Supplier Part Number 1: P220ADCT-ND; Supplier 1: Digi-Key; Mounting Type: SMD; LCSC Part #: C17557; Package: 0805
C32 = PCJ0J152MCL1GS: Supplier 1: Mouser; Supplier Part Number 1: 647-PCJ0J152MCL1GS; Manufacturer Part Number 1: PCJ0J152MCL1GS
U6 = LM2575HVS-3.3/NOPB: Package: None; Price: None; Value: *; MP: LM2575HVS-3.3/NOPB; Availability: Unavailable; Manufacturer Part Number 1: LM2575HVS-3.3/NOPB

## Sheet CAN.SchDoc
size A4; SheetNumber: 6; SheetTotal: 6
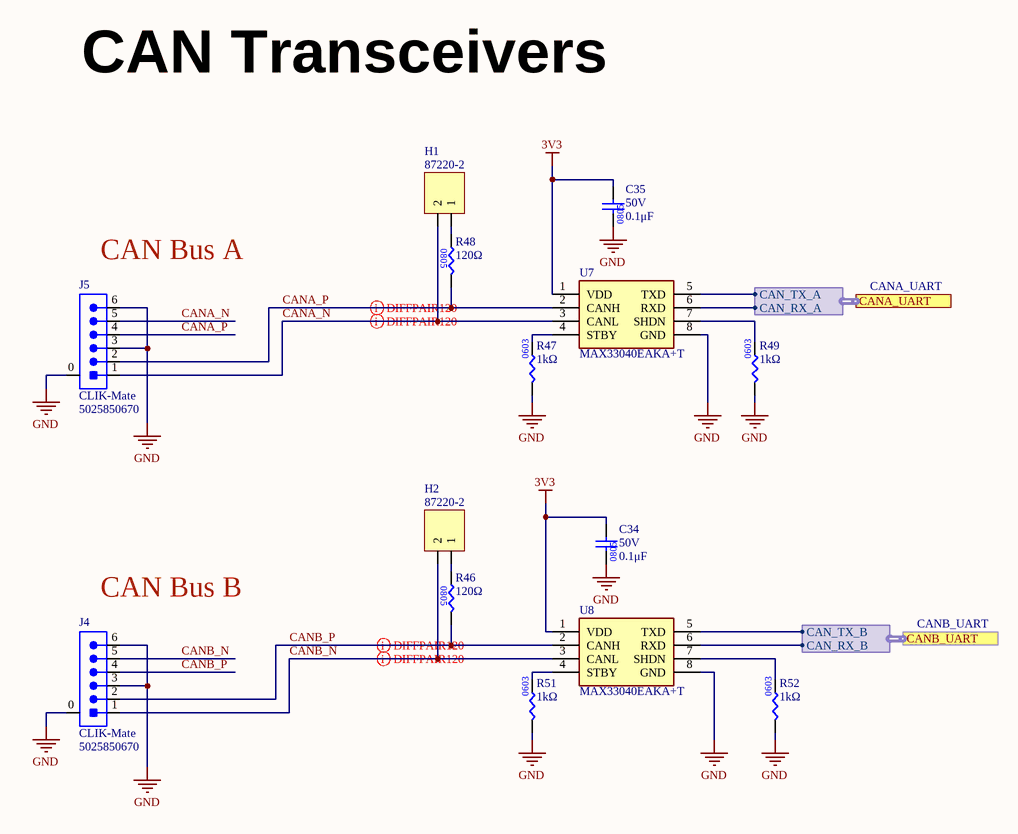
[diagram p5: CAN.SchDoc]

### Parts
C34  value 0.1μF  Voltage Rating: 50V  [CAP2012]  (hidden comment: CAP_0.1uF_50V_0805)
C35  value 0.1μF  Voltage Rating: 50V  [CAP2012]  (hidden comment: CAP_0.1uF_50V_0805)
H1  Manufacturer Part Number 1: 87220-2  [HDR1X2]  (hidden comment: JUMPER_2)
H2  Manufacturer Part Number 1: 87220-2  [HDR1X2]  (hidden comment: JUMPER_2)
J4  Family: CLIK-Mate  Manufacturer Part Number 1: 5025850670  [MOLEX-5025850670]  (hidden comment: CON_6M_SM_RA_1.5mm)
J5  Family: CLIK-Mate  Manufacturer Part Number 1: 5025850670  [MOLEX-5025850670]  (hidden comment: CON_6M_SM_RA_1.5mm)
R46  value 120Ω  [RES0805]  (hidden comment: RES_120Ω_0805_1%)
R47  value 1kΩ  [RES0603]  (hidden comment: RES_1kΩ_0603_5%)
R48  value 120Ω  [RES0805]  (hidden comment: RES_120Ω_0805_1%)
R49  value 1kΩ  [RES0603]  (hidden comment: RES_1kΩ_0603_5%)
R51  value 1kΩ  [RES0603]  (hidden comment: RES_1kΩ_0603_5%)
R52  value 1kΩ  [RES0603]  (hidden comment: RES_1kΩ_0603_5%)
U7  MAX33040EAKA+T  [SOT65P280X145-8N]
U8  MAX33040EAKA+T  [SOT65P280X145-8N]

### Ports
CANA_UART (harness CANA_UART), CANB_UART (harness CANB_UART)

### Harnesses
CANA_UART: CAN_RX_A, CAN_TX_A
CANB_UART: CAN_RX_B, CAN_TX_B

### Nets
3V3: C34.2 C35.2 U7.1(VDD) U8.1(VDD)
GND: C34.1 C35.1 J4.0 J4.3 J4.6 J5.0 J5.3 J5.6 R47.1 R49.1 R51.1 R52.1 U7.8(GND) U8.8(GND)
CANA_N: H1.2 J5.1 J5.5 U7.3(CANL)
CANA_P: J5.2 J5.4 R48.2 U7.2(CANH)
CANB_N: H2.2 J4.1 J4.5 U8.3(CANL)
CANB_P: J4.2 J4.4 R46.2 U8.2(CANH)
NetH1_1: H1.1 R48.1
NetH2_1: H2.1 R46.1
NetR47_2: R47.2 U7.4(STBY)
NetR49_2: R49.2 U7.7(SHDN)
NetR51_2: R51.2 U8.4(STBY)
NetR52_2: R52.2 U8.7(SHDN)
NetU2_33: U8.6(RXD) ; port CANB_UART.CAN_RX_B
NetU2_34: U8.5(TXD) ; port CANB_UART.CAN_TX_B
NetU2_44: U7.6(RXD) ; port CANA_UART.CAN_RX_A
NetU2_45: U7.5(TXD) ; port CANA_UART.CAN_TX_A

### Layout directives
differential pair; differential pair class CAN120: CANA_N, CANA_P, CANB_N, CANB_P

### Notes on the sheet
- CAN Transceivers
- (near J5) CAN Bus A
- (near J4) CAN Bus B

### Library data of the parts
C34 C35 = CAP_0.1uF_50V_0805: as C18 on sheet Microcontroller; Supplier Part Number 1: 490-8049-1-ND; Supplier 1: Digi-Key; Dielectric: X7R; LCSC Part #: C49678; Mounting Type: SMD
H1 H2 = JUMPER_2: HEADER 2X1; Manufacturer 1: TE Connectivity; Package/Footprint: TH; Supplier 1: Digi-Key; Supplier Part Number 1: A26542-ND; Mount: Through Hole; Mounting Type: TH
J4 J5 = CON_6M_SM_RA_1.5mm: CONN HEADER SMD RIGHT ANGLE 1.5 MM PITCH; Manufacturer 1: Molex; Supplier 1: Digi-Key; Supplier Part Number 1: WM12832CT-ND; Package/Footprint: SMD; Mounting Type: SMD
R46 R48 = RES_120Ω_0805_1%: as R30 on sheet Microcontroller; Supplier Part Number 1: 541-120CCT-ND; Supplier 1: Digi-Key; LCSC Part #: C17437; Mounting Type: SMD
R47 R49 R51 R52 = RES_1kΩ_0603_5%: as R1 on sheet BMSRev3; Supplier Part Number 1: 311-1.0KGRCT-ND; Supplier 1: Digi-Key; Mounting Type: SMD; LCSC Number: C14676
U7 U8 = MAX33040EAKA+T: Integrated Circuit; Manufacturer_Name: Maxim Integrated; Datasheet Link: https://datasheets.maximintegrated.com/en/ds/MAX33040E-MAX33041E.pdf; Height: 1.45mm; Mouser Part Number: 700-MAX33040EAKA+T; Mouser Price/Stock: https://www.mouser.co.uk/ProductDetail/Maxim-Integrated/MAX33040EAKA%2bT?qs=IS%252B4QmGtzzrp4y4r9nEH%252Bg%3D%3D; Manufacturer Part Number 1: MAX33040EAKA+T

## Nets that join several sheets
3V3: Microcontroller (16 pins), BMSRev3 (6 pins), Display (8 pins), Power (5 pins), CAN (C34.2 C35.2 U7.1 U8.1)
GND: Microcontroller (24 pins), BMSRev3 (12 pins), BatteryBalancingRev3 (Q13.2 TP15.1), Display (8 pins), Power (10 pins), CAN (14 pins)
VBAT: BMSRev3 (8 pins), Power (C33.1 J3.2 U6.1)
Cell6: BMSRev3 (J1.4), BatteryBalancingRev3 (Q12.2 R4.1 R6.1 TP4.1)
EN: Microcontroller (U2.41), BMSRev3 (R3.2 TP2.1 U1.79)
NetJ1_2: BMSRev3 (J1.2), BatteryBalancingRev3 (Q9.2 R20.1 R22.1 TP12.1)
NetJ1_3: BMSRev3 (J1.3), BatteryBalancingRev3 (Q4.2 R12.1 R14.1 TP8.1)
NetJ1_5: BMSRev3 (J1.5), BatteryBalancingRev3 (Q8.2 R19.1 R21.1 TP11.1)
NetJ1_6: BMSRev3 (J1.6), BatteryBalancingRev3 (Q5.2 R11.1 R13.1 TP7.1)
NetJ1_7: BMSRev3 (J1.7 U1.31), BatteryBalancingRev3 (R5.1 TP3.1)
NetJ1_9: BMSRev3 (J1.9), BatteryBalancingRev3 (Q11.2 R24.1 R26.1 TP14.1)
NetJ1_10: BMSRev3 (J1.10), BatteryBalancingRev3 (Q7.2 R16.1 R18.1 TP10.1)
NetJ1_11: BMSRev3 (J1.11), BatteryBalancingRev3 (Q3.2 R7.1 R9.1 TP5.1)
NetJ1_12: BMSRev3 (J1.12), BatteryBalancingRev3 (Q10.2 R23.1 R25.1 TP13.1)
NetJ1_13: BMSRev3 (J1.13), BatteryBalancingRev3 (Q6.2 R15.1 R17.1 TP9.1)
NetJ1_14: BMSRev3 (J1.14), BatteryBalancingRev3 (Q2.2 R8.1 R10.1 TP6.1)
NetQ1_1: Microcontroller (U2.25), BMSRev3 (Q1.1)
NetQ2_1: BMSRev3 (U1.32), BatteryBalancingRev3 (Q2.1)
NetQ3_1: BMSRev3 (U1.56), BatteryBalancingRev3 (Q3.1)
NetQ4_1: BMSRev3 (U1.60), BatteryBalancingRev3 (Q4.1)
NetQ5_1: BMSRev3 (U1.36), BatteryBalancingRev3 (Q5.1)
NetQ6_1: BMSRev3 (U1.40), BatteryBalancingRev3 (Q6.1)
NetQ7_1: BMSRev3 (U1.64), BatteryBalancingRev3 (Q7.1)
NetQ8_1: BMSRev3 (U1.44), BatteryBalancingRev3 (Q8.1)
NetQ9_1: BMSRev3 (U1.68), BatteryBalancingRev3 (Q9.1)
NetQ10_1: BMSRev3 (U1.48), BatteryBalancingRev3 (Q10.1)
NetQ11_1: BMSRev3 (U1.72), BatteryBalancingRev3 (Q11.1)
NetQ12_1: BMSRev3 (U1.52), BatteryBalancingRev3 (Q12.1)
NetQ13_1: BMSRev3 (U1.76), BatteryBalancingRev3 (Q13.1)
NetR4_2: BMSRev3 (U1.55), BatteryBalancingRev3 (R4.2)
NetR7_2: BMSRev3 (U1.59), BatteryBalancingRev3 (R7.2)
NetR8_2: BMSRev3 (U1.35), BatteryBalancingRev3 (R8.2)
NetR11_2: BMSRev3 (U1.39), BatteryBalancingRev3 (R11.2)
NetR12_2: BMSRev3 (U1.63), BatteryBalancingRev3 (R12.2)
NetR15_2: BMSRev3 (U1.43), BatteryBalancingRev3 (R15.2)
NetR16_2: BMSRev3 (U1.67), BatteryBalancingRev3 (R16.2)
NetR19_2: BMSRev3 (U1.47), BatteryBalancingRev3 (R19.2)
NetR20_2: BMSRev3 (U1.71), BatteryBalancingRev3 (R20.2)
NetR23_2: BMSRev3 (U1.51), BatteryBalancingRev3 (R23.2)
NetR24_2: BMSRev3 (U1.75), BatteryBalancingRev3 (R24.2)
NetTP16_1: Microcontroller (U2.21), BMSRev3 (TP16.1 U1.1)
NetTP17_1: Microcontroller (U2.23), BMSRev3 (TP17.1 U1.2)
NetTP18_1: Microcontroller (U2.22), BMSRev3 (TP18.1 U1.3)
NetU1_4: Microcontroller (U2.29), BMSRev3 (U1.4)
NetU1_80: Microcontroller (U2.42), BMSRev3 (U1.80)
NetU2_2: Microcontroller (U2.2), Display (U4.4)
NetU2_8: Microcontroller (U2.8), Display (U5.1)
NetU2_9: Microcontroller (U2.9), Display (U5.2)
NetU2_10: Microcontroller (U2.10), Display (U5.3)
NetU2_11: Microcontroller (U2.11), Display (U5.4)
NetU2_33: Microcontroller (U2.33), CAN (U8.6)
NetU2_34: Microcontroller (U2.34), CAN (U8.5)
NetU2_44: Microcontroller (U2.44), CAN (U7.6)
NetU2_45: Microcontroller (U2.45), CAN (U7.5)
NetU2_51: Microcontroller (U2.51), Display (U4.1)
NetU2_52: Microcontroller (U2.52), Display (U4.2)
NetU2_53: Microcontroller (U2.53), Display (U4.3)